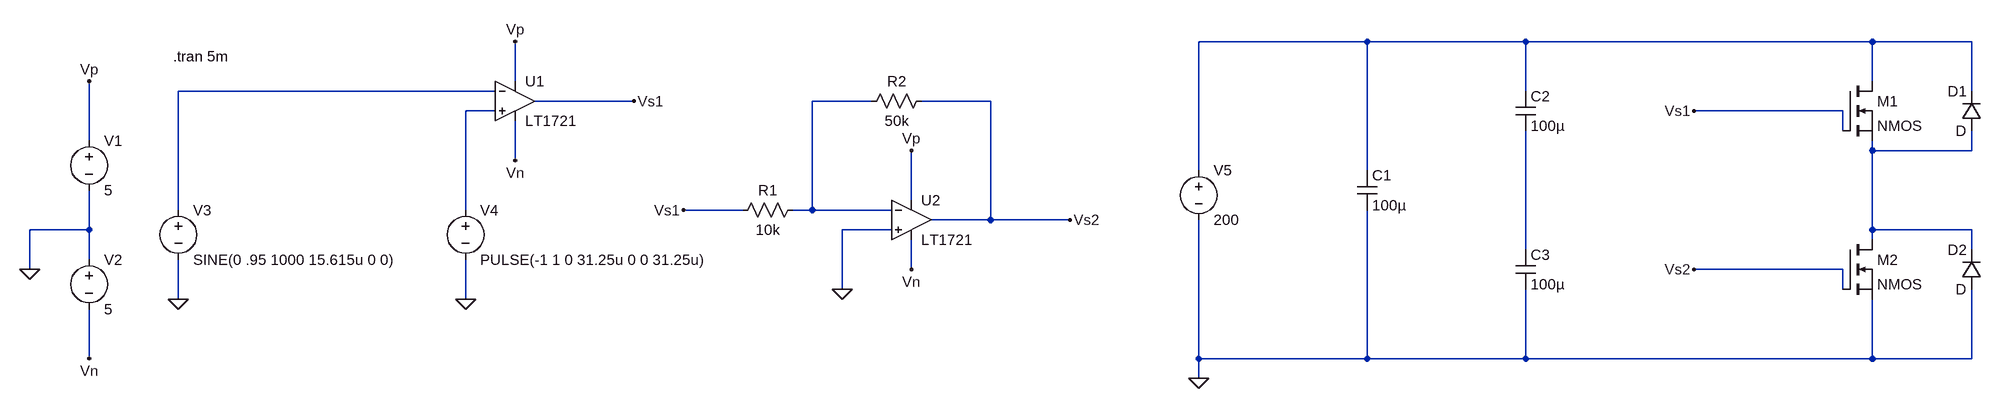
[diagram p0: schematic Half-Bridge Single Phase.asc]
Half-Bridge Single Phase.asc, the LTspice schematic file:
Version 4
SHEET 1 3188 680
WIRE 2192 -96 1920 -96
WIRE 2448 -96 2192 -96
WIRE 3008 -96 2448 -96
WIRE 3168 -96 3008 -96
WIRE 816 -32 816 -96
WIRE 3008 -32 3008 -96
WIRE 784 -16 272 -16
WIRE 2448 -16 2448 -96
WIRE 3168 -16 3168 -96
WIRE 1008 0 848 0
WIRE 1392 0 1296 0
WIRE 1584 0 1472 0
WIRE 784 16 736 16
WIRE 2960 16 2720 16
WIRE 2960 48 2960 16
WIRE 128 64 128 -32
WIRE 3008 80 3008 64
WIRE 3168 80 3168 48
WIRE 3168 80 3008 80
WIRE 816 96 816 32
WIRE 1920 112 1920 -96
WIRE 2192 112 2192 -96
WIRE 1456 160 1456 80
WIRE 272 176 272 -16
WIRE 736 176 736 16
WIRE 1184 176 1088 176
WIRE 1296 176 1296 0
WIRE 1296 176 1264 176
WIRE 1424 176 1296 176
WIRE 1584 192 1584 0
WIRE 1584 192 1488 192
WIRE 1712 192 1584 192
WIRE 128 208 128 144
WIRE 128 208 32 208
WIRE 1424 208 1344 208
WIRE 3008 208 3008 80
WIRE 3168 208 3008 208
WIRE 3008 224 3008 208
WIRE 2448 240 2448 48
WIRE 3168 240 3168 208
WIRE 128 256 128 208
WIRE 32 272 32 208
WIRE 1456 272 1456 224
WIRE 2960 272 2720 272
WIRE 1344 304 1344 208
WIRE 2960 304 2960 272
WIRE 272 320 272 256
WIRE 736 320 736 256
WIRE 128 416 128 336
WIRE 1920 416 1920 192
WIRE 2192 416 2192 176
WIRE 2192 416 1920 416
WIRE 2448 416 2448 304
WIRE 2448 416 2192 416
WIRE 3008 416 3008 320
WIRE 3008 416 2448 416
WIRE 3168 416 3168 304
WIRE 3168 416 3008 416
WIRE 1920 448 1920 416
FLAG 32 272 0
FLAG 128 -32 Vp
FLAG 128 416 Vn
FLAG 272 320 0
FLAG 736 320 0
FLAG 816 -96 Vp
FLAG 816 96 Vn
FLAG 1456 80 Vp
FLAG 1456 272 Vn
FLAG 1712 192 Vs2
FLAG 1344 304 0
FLAG 1008 0 Vs1
FLAG 1088 176 Vs1
FLAG 1920 448 0
FLAG 2720 16 Vs1
FLAG 2720 272 Vs2
SYMBOL voltage 128 48 R0
WINDOW 123 0 0 Left 0
WINDOW 39 0 0 Left 0
SYMATTR InstName V1
SYMATTR Value 5
SYMBOL voltage 128 240 R0
WINDOW 123 0 0 Left 0
WINDOW 39 0 0 Left 0
SYMATTR InstName V2
SYMATTR Value 5
SYMBOL Comparators\\LT1721 816 -64 R0
SYMATTR InstName U1
SYMBOL Comparators\\LT1721 1456 128 R0
SYMATTR InstName U2
SYMBOL voltage 272 160 R0
WINDOW 123 0 0 Left 0
WINDOW 39 0 0 Left 0
SYMATTR InstName V3
SYMATTR Value SINE(0 .95 1000 15.615u 0 0)
SYMBOL voltage 736 160 R0
WINDOW 123 0 0 Left 0
WINDOW 39 0 0 Left 0
SYMATTR InstName V4
SYMATTR Value PULSE(-1 1 0 31.25u 0 0 31.25u)
SYMBOL res 1280 160 R90
WINDOW 0 0 56 VBottom 2
WINDOW 3 32 56 VTop 2
SYMATTR InstName R1
SYMATTR Value 10k
SYMBOL res 1488 -16 R90
WINDOW 0 0 56 VBottom 2
WINDOW 3 32 56 VTop 2
SYMATTR InstName R2
SYMATTR Value 50k
SYMBOL voltage 1920 96 R0
WINDOW 123 0 0 Left 0
WINDOW 39 0 0 Left 0
SYMATTR InstName V5
SYMATTR Value 200
SYMBOL cap 2176 112 R0
SYMATTR InstName C1
SYMATTR Value 100µ
SYMBOL cap 2432 -16 R0
SYMATTR InstName C2
SYMATTR Value 100µ
SYMBOL cap 2432 240 R0
SYMATTR InstName C3
SYMATTR Value 100µ
SYMBOL nmos 2960 -32 R0
SYMATTR InstName M1
SYMBOL nmos 2960 224 R0
SYMATTR InstName M2
SYMBOL diode 3184 48 R180
WINDOW 0 24 64 Left 2
WINDOW 3 24 0 Left 2
SYMATTR InstName D1
SYMBOL diode 3184 304 R180
WINDOW 0 24 64 Left 2
WINDOW 3 24 0 Left 2
SYMATTR InstName D2
TEXT 264 -72 Left 2 !.tran 5m

The netlist it stands for:
* Half-Bridge Single Phase.asc
V1 Vp 0 5
V2 0 Vn 5
XU1 N004 N002 Vp Vn Vs1 LT1720  ; LT1721, pins In+ In- V+ V- OUT
XU2 0 N003 Vp Vn Vs2 LT1720  ; LT1721, pins In+ In- V+ V- OUT
V3 N002 0 SINE(0 .95 1000 15.615u 0 0)
V4 N004 0 PULSE(-1 1 0 31.25u 0 0 31.25u)
R1 N003 Vs1 10k
R2 Vs2 N003 50k
V5 N001 0 200
C1 N001 0 100µ
C2 N001 N006 100µ
C3 N006 0 100µ
M1 N001 Vs1 N005 N005 NMOS
M2 N005 Vs2 0 0 NMOS
D1 N005 N001 D
D2 0 N005 D
.model D D
.lib standard.dio
.model NMOS NMOS
.model PMOS PMOS
.lib standard.mos
.tran 5m
.lib LTC.lib
.backanno
.end